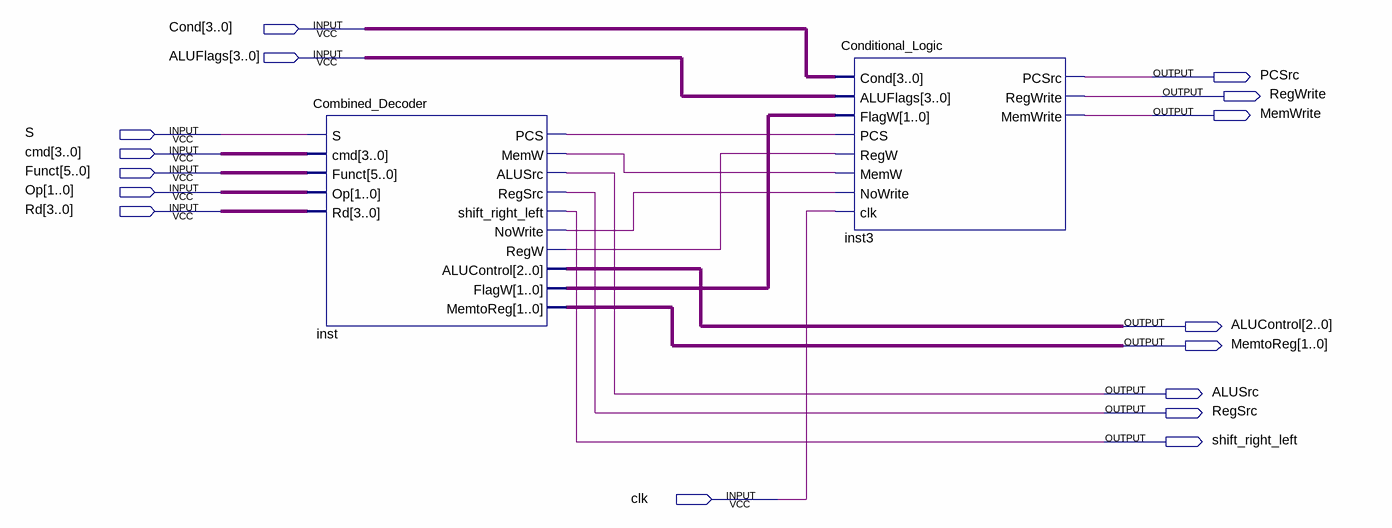
[diagram p0: schematic sheet]
// Quartus schematic Controller.bdf as structural Verilog: 2 symbols, 16 pins
module Controller (
  input  [3:0] Cond,
  input  [3:0] ALUFlags,
  input  S,
  input  [3:0] cmd,
  input  [5:0] Funct,
  input  [1:0] Op,
  input  [3:0] Rd,
  input  clk,
  output PCSrc,
  output RegWrite,
  output MemWrite,
  output [2:0] ALUControl,
  output [1:0] MemtoReg,
  output ALUSrc,
  output RegSrc,
  output shift_right_left
);

  wire inst_memw, inst_nowrite, inst_pcs, inst_regw;
  wire [1:0] inst_flagw;

  Combined_Decoder inst (
    .S(S), .cmd(cmd), .Funct(Funct), .Op(Op), .Rd(Rd), .PCS(inst_pcs), .MemW(inst_memw), .ALUSrc(ALUSrc),
    .RegSrc(RegSrc), .shift_right_left(shift_right_left), .NoWrite(inst_nowrite), .RegW(inst_regw),
    .ALUControl(ALUControl), .FlagW(inst_flagw), .MemtoReg(MemtoReg));
  Conditional_Logic inst3 (
    .Cond(Cond), .ALUFlags(ALUFlags), .FlagW(inst_flagw), .PCS(inst_pcs), .RegW(inst_regw), .MemW(inst_memw),
    .NoWrite(inst_nowrite), .clk(clk), .PCSrc(PCSrc), .RegWrite(RegWrite), .MemWrite(MemWrite));
endmodule
